# Altium schematic sheet Temperature_Sensing.SchDoc
size A
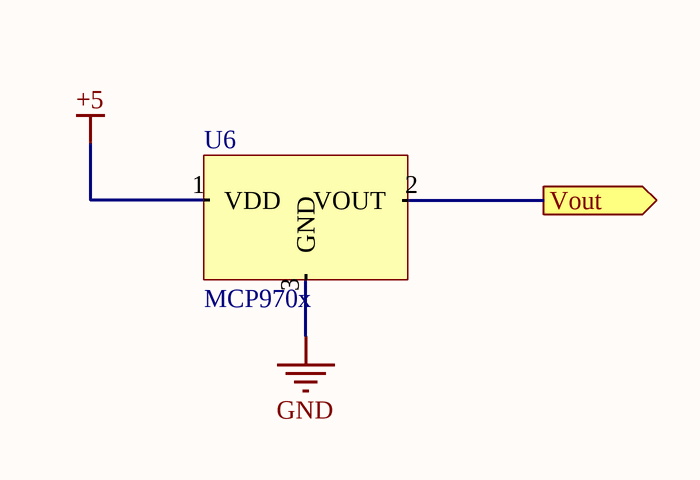
[diagram p0: Temperature_Sensing.SchDoc]

## Parts
U6  MCP970x  [SOT23-3]

## Ports
Vout (out)

## Nets
+5: U6.1(VDD)
GND: U6.3(GND)
Vout: U6.2(VOUT) ; port Vout

## Library data of the parts
U6 = 23: Manufacturer_id: 1; MfrPartNo: MCP9701T-E/TT; idFuse: 3; idIC_Misc: 23; Vin(Min): 3.1V; Vin(Max): 5.5V; Drawer_id: 1; Name: MCP970x; Package: SOT23-3; Link: https://www.digikey.com/product-detail/en/microchip-technology/MCP9701T-E-TT/MCP9701T-E-TTCT-ND/1987446